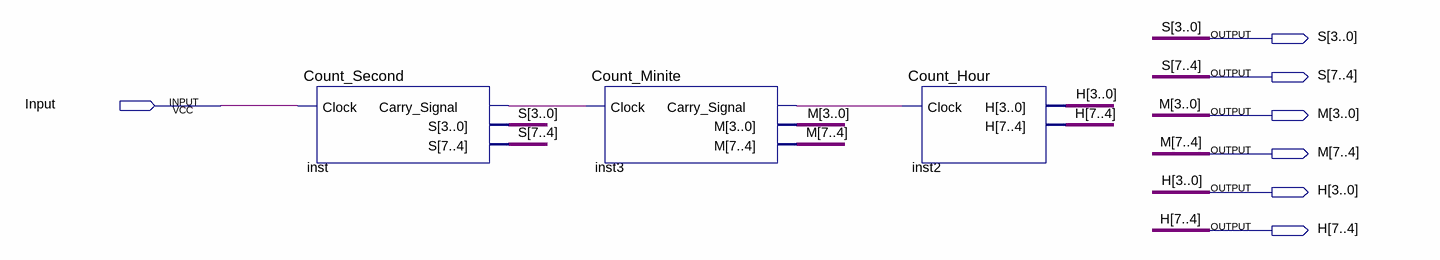
[diagram p0: schematic sheet]
// Quartus schematic Timing_Module.bdf as structural Verilog: 3 symbols, 7 pins
module Timing_Module (
  input  Input,
  output [7:0] S,
  output [7:0] M,
  output [7:0] H
);

  wire inst3_carry_signal, inst_carry_signal;

  Count_Second inst (.Clock(Input), .Carry_Signal(inst_carry_signal), .S(S));
  Count_Minite inst3 (.Clock(inst_carry_signal), .Carry_Signal(inst3_carry_signal), .M(M));
  Count_Hour inst2 (.Clock(inst3_carry_signal), .H(H));
endmodule
